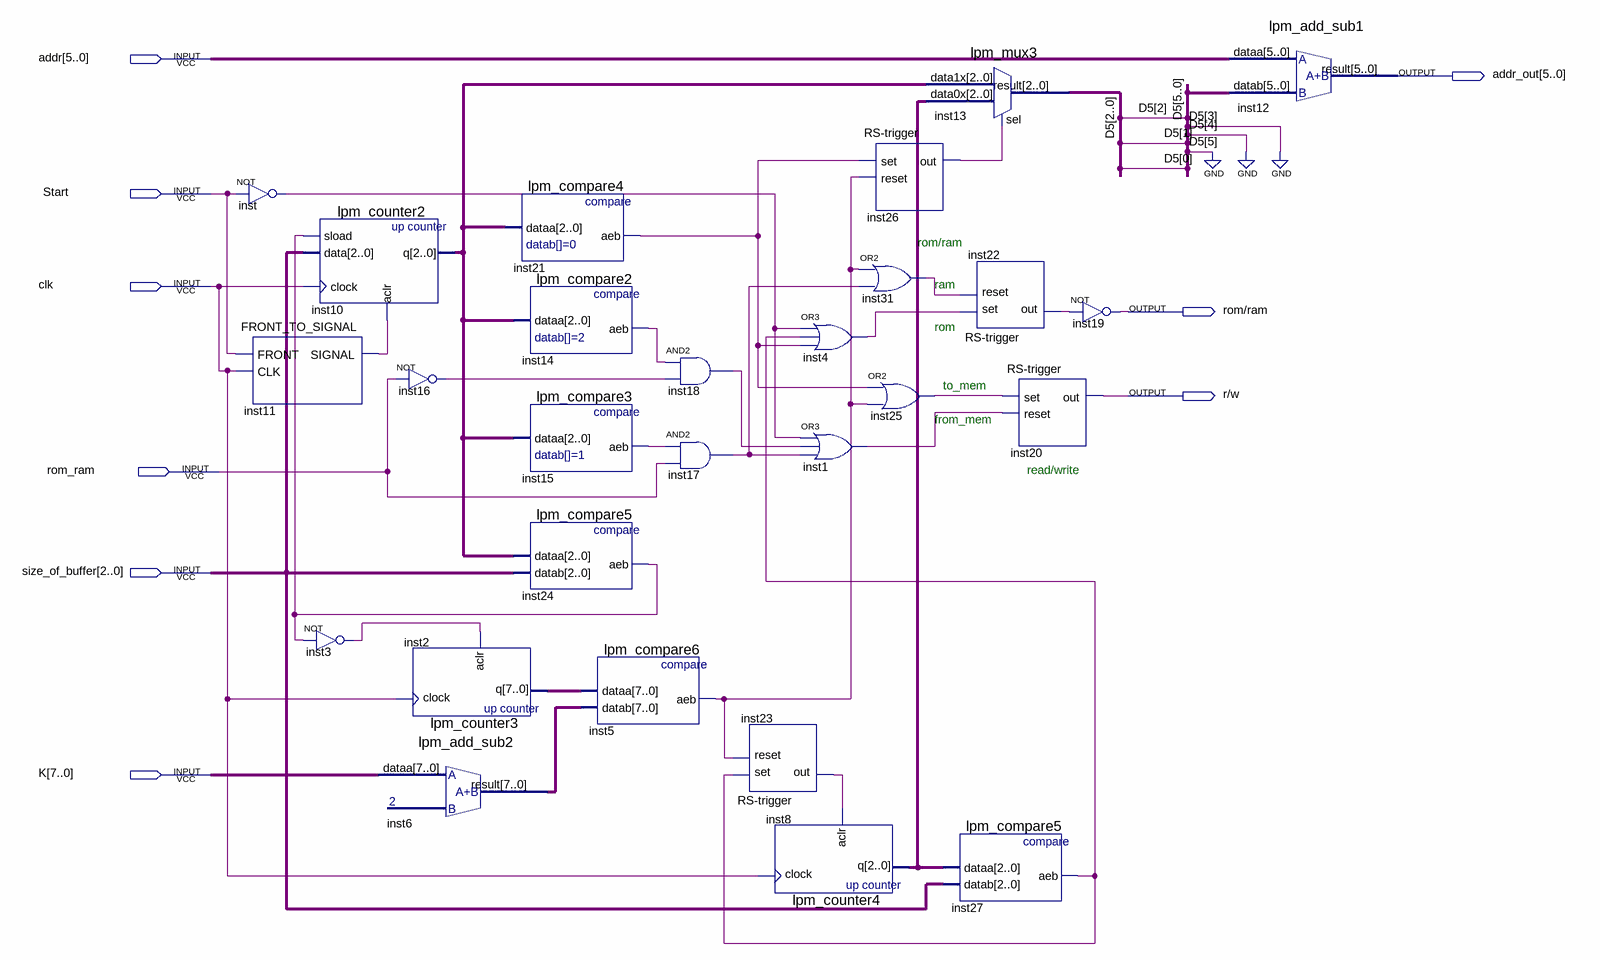
[diagram p0: schematic sheet]
// Quartus schematic Sandbox.bdf as structural Verilog: 27 symbols, 9 pins
module Sandbox (
  input  [5:0] addr,
  input  Start,
  input  clk,
  input  rom_ram,
  input  [2:0] size_of_buffer,
  input  [7:0] K,
  output [5:0] addr_out,
  output \rom/ram ,
  output \r/w 
);

  wire inst1_out, inst3_out, inst4_out, inst5_aeb, inst11_signal, inst14_aeb, inst15_aeb, inst16_out,
       inst17_out, inst18_out, inst21_aeb, inst22_out, inst23_out, inst24_aeb, inst25_out, inst26_out,
       inst27_aeb, inst31_out, inst_out;
  wire [2:0] D5, inst8_q, inst10_q;
  wire [7:0] inst2_q, inst6_result;

  not inst (inst_out, Start);
  FRONT_TO_SIGNAL inst11 (.FRONT(Start), .CLK(clk), .SIGNAL(inst11_signal));
  lpm_counter2 inst10 (.sload(inst24_aeb), .data(size_of_buffer), .clock(clk), .aclr(inst11_signal), .q(inst10_q));
  not inst3 (inst3_out, inst24_aeb);
  not inst16 (inst16_out, rom_ram);
  lpm_counter3 inst2 (.clock(clk), .aclr(inst3_out), .q(inst2_q));
  lpm_add_sub2 inst6 (.dataa(K), .result(inst6_result));
  lpm_compare4 inst21 (.dataa(inst10_q), .aeb(inst21_aeb));
  lpm_compare2 inst14 (.dataa(inst10_q), .aeb(inst14_aeb));
  lpm_compare3 inst15 (.dataa(inst10_q), .aeb(inst15_aeb));
  lpm_compare5 inst24 (.dataa(inst10_q), .datab(size_of_buffer), .aeb(inst24_aeb));
  lpm_compare6 inst5 (.dataa(inst2_q), .datab(inst6_result), .aeb(inst5_aeb));
  and inst18 (inst18_out, inst14_aeb, inst16_out);
  and inst17 (inst17_out, inst15_aeb, rom_ram);
  \RS-trigger  inst23 (.set(inst27_aeb), .reset(inst5_aeb), .out(inst23_out));
  or inst4 (inst4_out, inst_out, inst27_aeb, inst21_aeb);
  or inst1 (inst1_out, inst_out, inst18_out, inst17_out);
  lpm_counter4 inst8 (.clock(clk), .aclr(inst23_out), .q(inst8_q));
  \RS-trigger  inst26 (.set(inst21_aeb), .reset(inst5_aeb), .out(inst26_out));
  or inst31 (inst31_out, inst5_aeb, inst17_out);
  or inst25 (inst25_out, inst21_aeb, inst5_aeb);
  lpm_mux3 inst13 (.data1x(inst10_q), .data0x(inst8_q), .sel(inst26_out), .result(D5));
  \RS-trigger  inst22 (.set(inst4_out), .reset(inst31_out), .out(inst22_out));
  \RS-trigger  inst20 (.set(inst25_out), .reset(inst1_out), .out(\r/w ));
  lpm_compare5 inst27 (.dataa(inst8_q), .datab(size_of_buffer), .aeb(inst27_aeb));
  not inst19 (\rom/ram , inst22_out);
  lpm_add_sub1 inst12 (.dataa(addr), .datab({3'b000, D5}), .result(addr_out));

  // Notes on the sheet:
  //   rom/ram
  //   ram
  //   rom
  //   to_mem
  //   from_mem
  //   read/write
endmodule
